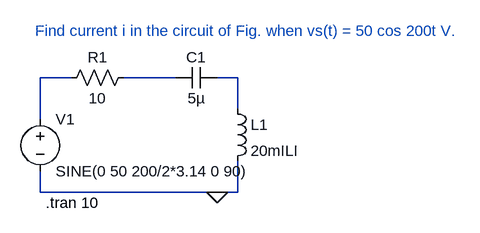
[diagram p0: schematic Lab5_ques5.asc]
Lab5_ques5.asc, the LTspice schematic file:
Version 4
SHEET 1 880 680
WIRE 48 144 0 144
WIRE 208 144 128 144
WIRE 304 144 272 144
WIRE 304 192 304 144
WIRE 0 208 0 144
WIRE 0 320 0 288
WIRE 272 320 0 320
WIRE 304 320 304 272
WIRE 304 320 272 320
FLAG 272 320 0
SYMBOL Voltage 0 192 R0
SYMATTR InstName V1
SYMATTR Value SINE(0 50 200/2*3.14 0 90)
SYMBOL Ind 288 176 R0
SYMATTR InstName L1
SYMATTR Value 20mILI
SYMBOL Cap 272 128 R90
WINDOW 0 0 32 VBottom 2
WINDOW 3 32 32 VTop 2
SYMATTR InstName C1
SYMATTR Value 5µ
SYMBOL Res 144 128 R90
WINDOW 0 0 56 VBottom 2
WINDOW 3 32 56 VTop 2
SYMATTR InstName R1
SYMATTR Value 10
TEXT -8 72 Left 2 ;Find current i in the circuit of Fig. when vs(t) = 50 cos 200t V.
TEXT 8 336 Left 2 !.tran 10

The netlist it stands for:
* Lab5_ques5.asc
V1 N001 0 SINE(0 50 200/2*3.14 0 90)
L1 N003 0 20mILI
C1 N003 N002 5µ
R1 N002 N001 10
* Find current i in the circuit of Fig. when vs(t) = 50 cos 200t V.
.tran 10
.backanno
.end